# Altium schematic sheet phoenix-c1-sch.SchDoc
size A4; SheetNumber: 1; SheetTotal: 11
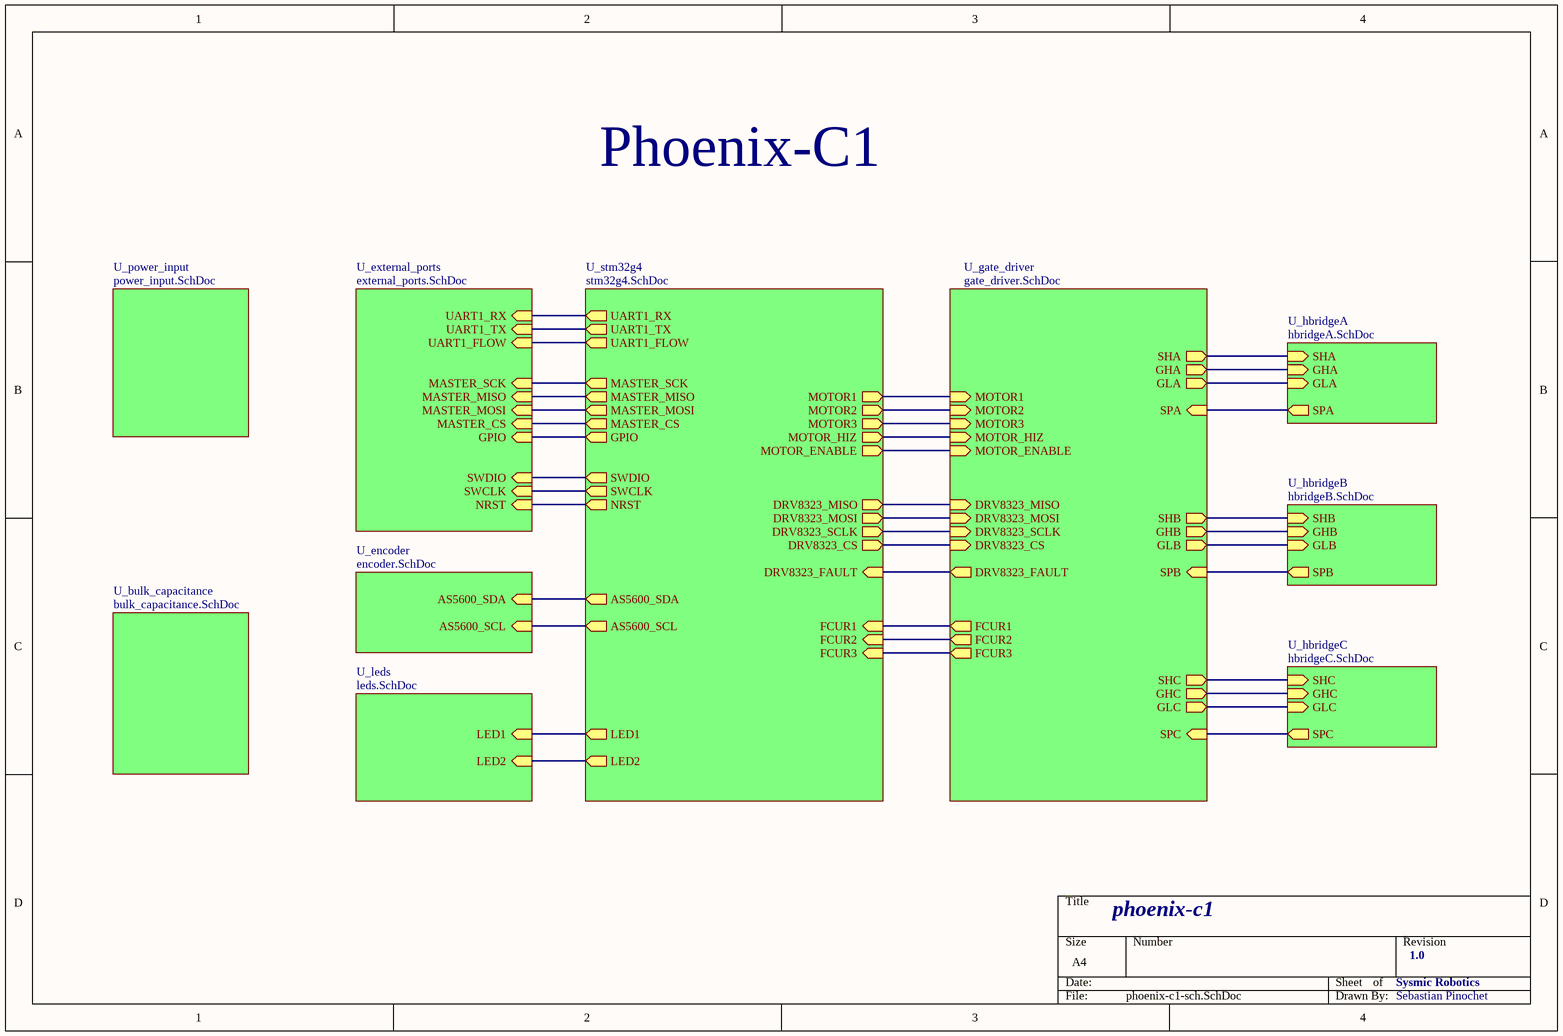
[diagram p0: phoenix-c1-sch.SchDoc]

## Sub-sheets
U_bulk_capacitance = bulk_capacitance.SchDoc: no entries
U_encoder = encoder.SchDoc: AS5600_SCL (in), AS5600_SDA (in)
U_external_ports = external_ports.SchDoc: SWCLK (in), NRST (in), SWDIO (in), GPIO (in), MASTER_CS (in), MASTER_MOSI (in), MASTER_MISO (in), MASTER_SCK (in), UART1_RX (in), UART1_TX (in), UART1_FLOW (in)
U_gate_driver = gate_driver.SchDoc: MOTOR2 (in), MOTOR1 (in), MOTOR3 (in), MOTOR_ENABLE (in), DRV8323_MISO (in), DRV8323_MOSI (in), DRV8323_SCLK (in), DRV8323_CS (in), MOTOR_HIZ (in), DRV8323_FAULT (out), GHA (out), SHA (out), GLA (out), SPA (in), GHB (out), SHB (out), GLB (out), SPB (in), GHC (out), SHC (out), GLC (out), SPC (in), FCUR1 (out), FCUR2 (out), FCUR3 (out)
U_hbridgeA = hbridgeA.SchDoc: SHA (in), GHA (in), SPA (out), GLA (in)
U_hbridgeB = hbridgeB.SchDoc: SHB (in), GHB (in), SPB (out), GLB (in)
U_hbridgeC = hbridgeC.SchDoc: SHC (in), GHC (in), SPC (out), GLC (in)
U_leds = leds.SchDoc: LED1 (in), LED2 (in)
U_power_input = power_input.SchDoc: no entries
U_stm32g4 = stm32g4.SchDoc: MOTOR1 (out), MOTOR2 (out), MOTOR3 (out), FCUR1 (in), FCUR2 (in), FCUR3 (in), AS5600_SCL (out), AS5600_SDA (out), DRV8323_SCLK (out), DRV8323_MISO (out), DRV8323_MOSI (out), DRV8323_CS (out), DRV8323_FAULT (in), MOTOR_HIZ (out), MOTOR_ENABLE (out), GPIO (out), MASTER_CS (out), MASTER_MOSI (out), MASTER_MISO (out), MASTER_SCK (out), UART1_RX (out), UART1_TX (out), UART1_FLOW (out), LED1 (out), LED2 (out), SWCLK (out), NRST (out), SWDIO (out)

## Nets
(unnamed): sheet U_encoder/AS5600_SCL, sheet U_stm32g4/AS5600_SCL
(unnamed): sheet U_encoder/AS5600_SDA, sheet U_stm32g4/AS5600_SDA
(unnamed): sheet U_hbridgeA/SHA, sheet U_gate_driver/SHA
(unnamed): sheet U_hbridgeA/GHA, sheet U_gate_driver/GHA
(unnamed): sheet U_hbridgeA/SPA, sheet U_gate_driver/SPA
(unnamed): sheet U_hbridgeA/GLA, sheet U_gate_driver/GLA
(unnamed): sheet U_hbridgeB/SHB, sheet U_gate_driver/SHB
(unnamed): sheet U_hbridgeB/GHB, sheet U_gate_driver/GHB
(unnamed): sheet U_hbridgeB/SPB, sheet U_gate_driver/SPB
(unnamed): sheet U_hbridgeB/GLB, sheet U_gate_driver/GLB
(unnamed): sheet U_hbridgeC/SHC, sheet U_gate_driver/SHC
(unnamed): sheet U_hbridgeC/GHC, sheet U_gate_driver/GHC
(unnamed): sheet U_hbridgeC/SPC, sheet U_gate_driver/SPC
(unnamed): sheet U_hbridgeC/GLC, sheet U_gate_driver/GLC
(unnamed): sheet U_stm32g4/MOTOR1, sheet U_gate_driver/MOTOR1
(unnamed): sheet U_stm32g4/MOTOR2, sheet U_gate_driver/MOTOR2
(unnamed): sheet U_stm32g4/MOTOR3, sheet U_gate_driver/MOTOR3
(unnamed): sheet U_stm32g4/FCUR1, sheet U_gate_driver/FCUR1
(unnamed): sheet U_stm32g4/FCUR2, sheet U_gate_driver/FCUR2
(unnamed): sheet U_stm32g4/FCUR3, sheet U_gate_driver/FCUR3
(unnamed): sheet U_stm32g4/DRV8323_SCLK, sheet U_gate_driver/DRV8323_SCLK
(unnamed): sheet U_stm32g4/DRV8323_MISO, sheet U_gate_driver/DRV8323_MISO
(unnamed): sheet U_stm32g4/DRV8323_MOSI, sheet U_gate_driver/DRV8323_MOSI
(unnamed): sheet U_stm32g4/DRV8323_CS, sheet U_gate_driver/DRV8323_CS
(unnamed): sheet U_stm32g4/DRV8323_FAULT, sheet U_gate_driver/DRV8323_FAULT
(unnamed): sheet U_stm32g4/MOTOR_HIZ, sheet U_gate_driver/MOTOR_HIZ
(unnamed): sheet U_stm32g4/MOTOR_ENABLE, sheet U_gate_driver/MOTOR_ENABLE
(unnamed): sheet U_stm32g4/GPIO, sheet U_external_ports/GPIO
(unnamed): sheet U_stm32g4/MASTER_CS, sheet U_external_ports/MASTER_CS
(unnamed): sheet U_stm32g4/MASTER_MOSI, sheet U_external_ports/MASTER_MOSI
(unnamed): sheet U_stm32g4/MASTER_MISO, sheet U_external_ports/MASTER_MISO
(unnamed): sheet U_stm32g4/MASTER_SCK, sheet U_external_ports/MASTER_SCK
(unnamed): sheet U_stm32g4/UART1_RX, sheet U_external_ports/UART1_RX
(unnamed): sheet U_stm32g4/UART1_TX, sheet U_external_ports/UART1_TX
(unnamed): sheet U_stm32g4/UART1_FLOW, sheet U_external_ports/UART1_FLOW
(unnamed): sheet U_stm32g4/LED1, sheet U_leds/LED1
(unnamed): sheet U_stm32g4/LED2, sheet U_leds/LED2
(unnamed): sheet U_stm32g4/SWCLK, sheet U_external_ports/SWCLK
(unnamed): sheet U_stm32g4/NRST, sheet U_external_ports/NRST
(unnamed): sheet U_stm32g4/SWDIO, sheet U_external_ports/SWDIO

## Notes on the sheet
- Phoenix-C1
- phoenix-c1
- Sysmic Robotics
- 1.0
- Sebastian Pinochet